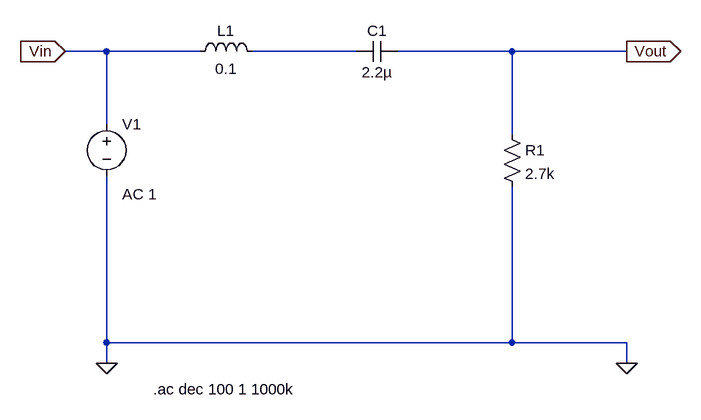
[diagram p0: schematic RLC_BPF.asc]
RLC_BPF.asc, the LTspice schematic file:
Version 4
SHEET 1 960 680
WIRE 48 32 -16 32
WIRE 192 32 48 32
WIRE 432 32 272 32
WIRE 672 32 496 32
WIRE 848 32 672 32
WIRE 48 144 48 32
WIRE 672 160 672 32
WIRE 48 480 48 224
WIRE 672 480 672 240
WIRE 672 480 48 480
WIRE 848 480 672 480
WIRE 48 512 48 480
WIRE 848 512 848 480
FLAG 48 512 0
FLAG -16 32 Vin
IOPIN -16 32 In
FLAG 848 512 0
FLAG 848 32 Vout
IOPIN 848 32 Out
SYMBOL voltage 48 128 R0
WINDOW 123 24 124 Left 2
WINDOW 39 0 0 Left 0
SYMATTR InstName V1
SYMATTR Value ""
SYMATTR Value2 AC 1
SYMBOL ind 176 48 R270
WINDOW 0 32 56 VTop 2
WINDOW 3 5 56 VBottom 2
SYMATTR InstName L1
SYMATTR Value 0.1
SYMBOL cap 496 16 R90
WINDOW 0 0 32 VBottom 2
WINDOW 3 32 32 VTop 2
SYMATTR InstName C1
SYMATTR Value 2.2µ
SYMBOL res 656 144 R0
SYMATTR InstName R1
SYMATTR Value 2.7k
TEXT 120 552 Left 2 !.ac dec 100 1 1000k

The netlist it stands for:
* RLC_BPF.asc
V1 Vin 0 AC 1
L1 Vin N001 0.1
C1 Vout N001 2.2µ
R1 Vout 0 2.7k
.ac dec 100 1 1000k
.backanno
.end